# Altium schematic sheet CAN_HTTP_Enabled.SCHDOC: Weather Station with CAN interface
size C; Organization: Altium Limited; Address1: L3, 12a Rodborough Rd; Address2: Frenchs Forest; Address3: NSW; Address4: Australia 2086; DocumentNumber: 1; SheetNumber: 1; SheetTotal: 2
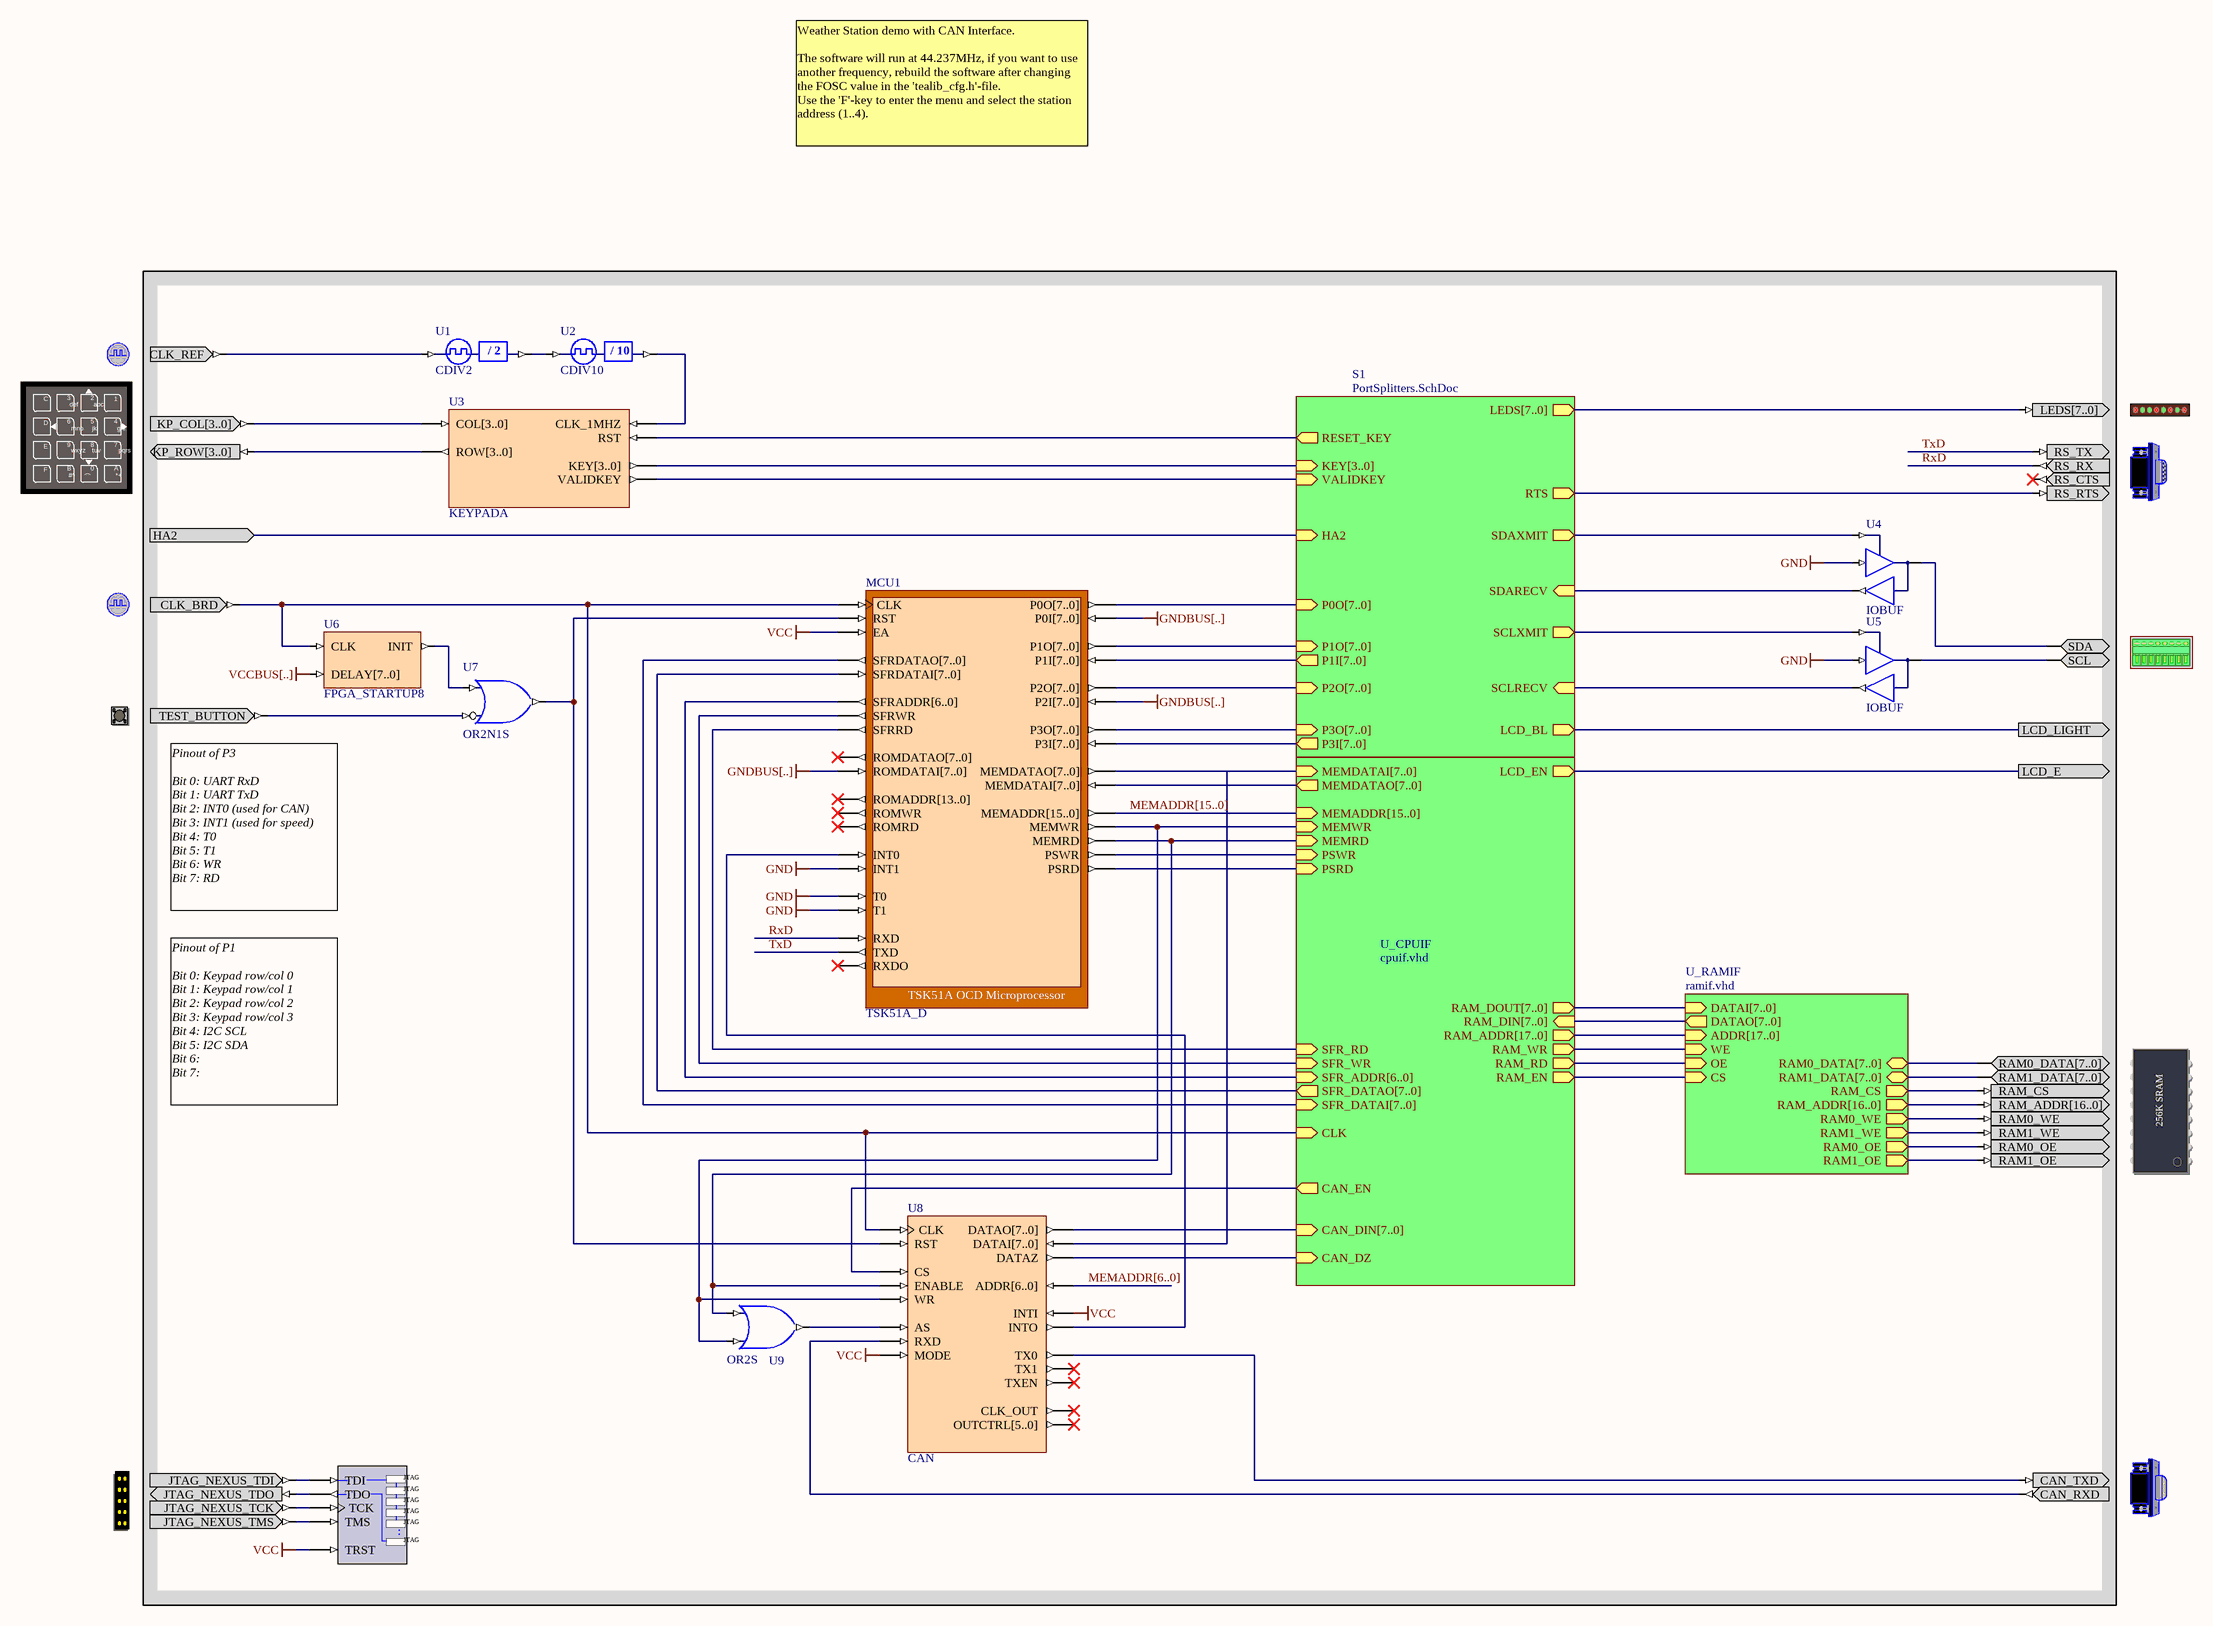
[diagram p0: CAN_HTTP_Enabled.SCHDOC]

## Parts
(Parts that share a designator on the sheet are numbered #1, #2 ... from top to bottom, then left to right.)
?#1  CLOCK_REFERENCE  (value not drawn)
?#2  KEYPAD  (value not drawn)
?#3  LED  (value not drawn)
?#4  RS232CNTR  (value not drawn)
?#5  CLOCK_BOARD  (value not drawn)
?#6  ADCDAC_I2C  (value not drawn)
?#7  TEST_BUTTON  (value not drawn)
?#8  MEMORY256KX8  (value not drawn)
?#9  CANCNTR  (value not drawn)
?#10  NEXUS_JTAG_CONNECTOR  (value not drawn)
MCU1  TSK51A_D
NEXUS_JTAG_PORT  NEXUS_JTAG_PORT  (value not drawn)
U1  CDIV2
U2  CDIV10
U3  KEYPADA
U4  IOBUF
U5  IOBUF
U6  FPGA_STARTUP8
U7  OR2N1S
U8  CAN
U9  OR2S

## Sub-sheets
S1 = PortSplitters.SchDoc: P0O[7..0] (in), P1O[7..0] (in), P1I[7..0] (out), P2O[7..0] (in), P3O[7..0] (in), P3I[7..0] (out), HA2 (in), SCLXMIT (out), LCD_BL (out), RTS (out), SDAXMIT (out), VALIDKEY (in), KEY[3..0] (in), SCLRECV (in), SDARECV (in), RESET_KEY (out), LEDS[7..0] (out)
U_CPUIF = cpuif.vhd: MEMWR (in), RAM_EN (out), RAM_WR (out), RAM_RD (out), RAM_DOUT[7..0] (out), MEMRD (in), LCD_EN (out), RAM_ADDR[17..0] (out), CLK (in), SFR_ADDR[6..0] (in), SFR_DATAI[7..0] (in), SFR_DATAO[7..0] (out), SFR_WR (in), SFR_RD (in), RAM_DIN[7..0] (in), PSWR (in), PSRD (in), MEMADDR[15..0] (in), MEMDATAI[7..0] (in), MEMDATAO[7..0] (out), CAN_EN (out), CAN_DIN[7..0] (in), CAN_DZ (in)
U_RAMIF = ramif.vhd: DATAI[7..0] (in), DATAO[7..0] (out), ADDR[17..0] (in), WE (in), OE (in), CS (in), RAM0_DATA[7..0] (bidir), RAM1_DATA[7..0] (bidir), RAM_ADDR[16..0] (out), RAM0_WE (out), RAM1_WE (out), RAM0_OE (out), RAM1_OE (out), RAM_CS (out)

## Ports
HA2 (in), LCD_E (out), LCD_LIGHT (out)

## Nets
GND: MCU1.INT1 MCU1.T0 MCU1.T1 U4.I U5.I
GNDBUS[..]: MCU1.P0I[7..0] MCU1.P2I[7..0] MCU1.ROMDATAI[7..0]
VCC: MCU1.EA NEXUS_JTAG_PORT.TRST U8.INTI U8.MODE
VCCBUS[..]: U6.DELAY[7..0]
HA2: port HA2, sheet S1/HA2
LCD_E: port LCD_E, sheet U_CPUIF/LCD_EN
LCD_LIGHT: port LCD_LIGHT, sheet S1/LCD_BL
MEMADDR[6..0]: U8.ADDR[6..0]
MEMADDR[15..0]: MCU1.MEMADDR[15..0] ; sheet U_CPUIF/MEMADDR[15..0]
RxD: ?#4.RS_RX MCU1.RXD
TxD: ?#4.RS_TX MCU1.TXD
Net?#1_CLK_REF: ?#1.CLK_REF U1.CLKIN
Net?#2_KP_COL[3..0]: ?#2.KP_COL[3..0] U3.COL[3..0]
Net?#2_KP_ROW[3..0]: ?#2.KP_ROW[3..0] U3.ROW[3..0]
Net?#3_LEDS[7..0]: ?#3.LEDS[7..0] ; sheet S1/LEDS[7..0]
Net?#4_RS_RTS: ?#4.RS_RTS ; sheet S1/RTS
Net?#5_CLK_BRD: ?#5.CLK_BRD MCU1.CLK U6.CLK U8.CLK ; sheet U_CPUIF/CLK
Net?#6_SCL: ?#6.SCL U5.IO
Net?#6_SDA: ?#6.SDA U4.IO
Net?#7_TEST_BUTTON: ?#7.TEST_BUTTON U7.I0
Net?#8_RAM0_DATA[7..0]: ?#8.RAM0_DATA[7..0] ; sheet U_RAMIF/RAM0_DATA[7..0]
Net?#8_RAM0_OE: ?#8.RAM0_OE ; sheet U_RAMIF/RAM0_OE
Net?#8_RAM0_WE: ?#8.RAM0_WE ; sheet U_RAMIF/RAM0_WE
Net?#8_RAM1_DATA[7..0]: ?#8.RAM1_DATA[7..0] ; sheet U_RAMIF/RAM1_DATA[7..0]
Net?#8_RAM1_OE: ?#8.RAM1_OE ; sheet U_RAMIF/RAM1_OE
Net?#8_RAM1_WE: ?#8.RAM1_WE ; sheet U_RAMIF/RAM1_WE
Net?#8_RAM_ADDR[16..0]: ?#8.RAM_ADDR[16..0] ; sheet U_RAMIF/RAM_ADDR[16..0]
Net?#8_RAM_CS: ?#8.RAM_CS ; sheet U_RAMIF/RAM_CS
Net?#9_CAN_RXD: ?#9.CAN_RXD U8.RXD
Net?#9_CAN_TXD: ?#9.CAN_TXD U8.TX0
Net?#10_JTAG_NEXUS_TCK: ?#10.JTAG_NEXUS_TCK NEXUS_JTAG_PORT.TCK
Net?#10_JTAG_NEXUS_TDI: ?#10.JTAG_NEXUS_TDI NEXUS_JTAG_PORT.TDI
Net?#10_JTAG_NEXUS_TDO: ?#10.JTAG_NEXUS_TDO NEXUS_JTAG_PORT.TDO
Net?#10_JTAG_NEXUS_TMS: ?#10.JTAG_NEXUS_TMS NEXUS_JTAG_PORT.TMS
NetMCU1_INT0: MCU1.INT0 U8.INTO
NetMCU1_MEMDATAI[7..0]: MCU1.MEMDATAI[7..0] ; sheet U_CPUIF/MEMDATAO[7..0]
NetMCU1_MEMDATAO[7..0]: MCU1.MEMDATAO[7..0] U8.DATAI[7..0] ; sheet U_CPUIF/MEMDATAI[7..0]
NetMCU1_MEMRD: MCU1.MEMRD U8.ENABLE U9.I0 ; sheet U_CPUIF/MEMRD
NetMCU1_MEMWR: MCU1.MEMWR U8.WR U9.I1 ; sheet U_CPUIF/MEMWR
NetMCU1_P0O[7..0]: MCU1.P0O[7..0] ; sheet S1/P0O[7..0]
NetMCU1_P1I[7..0]: MCU1.P1I[7..0] ; sheet S1/P1I[7..0]
NetMCU1_P1O[7..0]: MCU1.P1O[7..0] ; sheet S1/P1O[7..0]
NetMCU1_P2O[7..0]: MCU1.P2O[7..0] ; sheet S1/P2O[7..0]
NetMCU1_P3I[7..0]: MCU1.P3I[7..0] ; sheet S1/P3I[7..0]
NetMCU1_P3O[7..0]: MCU1.P3O[7..0] ; sheet S1/P3O[7..0]
NetMCU1_PSRD: MCU1.PSRD ; sheet U_CPUIF/PSRD
NetMCU1_PSWR: MCU1.PSWR ; sheet U_CPUIF/PSWR
NetMCU1_RST: MCU1.RST U7.O U8.RST
NetMCU1_SFRADDR[6..0]: MCU1.SFRADDR[6..0] ; sheet U_CPUIF/SFR_ADDR[6..0]
NetMCU1_SFRDATAI[7..0]: MCU1.SFRDATAI[7..0] ; sheet U_CPUIF/SFR_DATAO[7..0]
NetMCU1_SFRDATAO[7..0]: MCU1.SFRDATAO[7..0] ; sheet U_CPUIF/SFR_DATAI[7..0]
NetMCU1_SFRRD: MCU1.SFRRD ; sheet U_CPUIF/SFR_RD
NetMCU1_SFRWR: MCU1.SFRWR ; sheet U_CPUIF/SFR_WR
NetU1_CLKDV: U1.CLKDV U2.CLKIN
NetU2_CLKDV: U2.CLKDV U3.CLK_1MHZ
NetU3_KEY[3..0]: U3.KEY[3..0] ; sheet S1/KEY[3..0]
NetU3_RST: U3.RST ; sheet S1/RESET_KEY
NetU3_VALIDKEY: U3.VALIDKEY ; sheet S1/VALIDKEY
NetU4_O: U4.O ; sheet S1/SDARECV
NetU4_T: U4.T ; sheet S1/SDAXMIT
NetU5_O: U5.O ; sheet S1/SCLRECV
NetU5_T: U5.T ; sheet S1/SCLXMIT
NetU6_INIT: U6.INIT U7.I1
NetU8_AS: U8.AS U9.O
NetU8_CS: U8.CS ; sheet U_CPUIF/CAN_EN
NetU8_DATAO[7..0]: U8.DATAO[7..0] ; sheet U_CPUIF/CAN_DIN[7..0]
NetU8_DATAZ: U8.DATAZ ; sheet U_CPUIF/CAN_DZ
(unnamed): sheet U_CPUIF/RAM_EN, sheet U_RAMIF/CS
(unnamed): sheet U_CPUIF/RAM_WR, sheet U_RAMIF/WE
(unnamed): sheet U_CPUIF/RAM_RD, sheet U_RAMIF/OE

Not connected (* = marked no-connect by the designer): ?#4 RS_CTS*; MCU1 ROMADDR[13..0]* ROMDATAO[7..0]* ROMRD* ROMWR* RXDO*; U8 CLK_OUT* OUTCTRL[5..0]* TX1* TXEN*

## Buses and harness runs
bus MEMADDR[6..0]
bus MEMADDR[15..0] = sheet U_CPUIF/MEMADDR[15..0]
bus sheet U_CPUIF/RAM_ADDR[17..0] = sheet U_RAMIF/ADDR[17..0]
bus sheet U_CPUIF/RAM_DIN[7..0] = sheet U_RAMIF/DATAO[7..0]
bus sheet U_CPUIF/RAM_DOUT[7..0] = sheet U_RAMIF/DATAI[7..0]

## Notes on the sheet
- Weather Station demo with CAN Interface.
  The software will run at 44.237MHz, if you want to use another frequency, rebuild the software after changing the FOSC value in the 'tealib_cfg.h'-file.
  Use the 'F'-key to enter the menu and select the station address (1..4).
- Pinout of P3
  Bit 0: UART RxD
  Bit 1: UART TxD
  Bit 2: INT0 (used for CAN)
  Bit 3: INT1 (used for speed)
  Bit 4: T0
  Bit 5: T1
  Bit 6: WR
  Bit 7: RD
- Pinout of P1
  Bit 0: Keypad row/col 0
  Bit 1: Keypad row/col 1
  Bit 2: Keypad row/col 2
  Bit 3: Keypad row/col 3
  Bit 4: I2C SCL
  Bit 5: I2C SDA
  Bit 6:
  Bit 7:
- Title
- Size:
- Date:
- File:
- C
- Number:
- Time:
- Revision:
- Sheet
- of
- (in symbol CDIV2) / 2
- (in symbol CDIV10) / 10
- (in symbol KEYPAD) C; 3; 2; 1; def; abc; 6; 5; 4; D; mno; jkl; ghi; E; 9; 8; 7; wxyz; tuv; pqrs; F; B; 0; A; #^; (; *+
- (in symbol MEMORY256KX8) 256K SRAM
- (in symbol NEXUS_JTAG_PORT) JTAG; .

## Library data of the parts
?#1 = CLOCK_REFERENCE: Global System Clock Reference Supply; PortComponent: True; Published: 19-Nov-2003; Publisher: Altium Limited
?#2 = KEYPAD: Key Pad; PortComponent: True; Published: 19-Nov-2003; Publisher: Altium Limited
?#3 = LED: 8-Way LEDS; PortComponent: True; Published: 19-Nov-2003; Publisher: Altium Limited
?#4 = RS232CNTR: DCE Serial Port Connector; PortComponent: True; Published: 19-Nov-2003; Publisher: Altium Limited
?#5 = CLOCK_BOARD: Global System Clock Supply; PortComponent: True; Published: 19-Nov-2003; Publisher: Altium Limited
?#6 = ADCDAC_I2C: Analog Digital/ Digital Analog Converter, I2C Interface; PortComponent: True; Published: 19-Nov-2003; Publisher: Altium Limited
?#7 = TEST_BUTTON: Test Button; PortComponent: True; Published: 19-Nov-2003; Publisher: Altium Limited
?#8 = MEMORY256KX8: SRAM 256kx8; PortComponent: True; Published: 19-Nov-2003; Publisher: Altium Limited
?#9 = CANCNTR: CAN Bus Connector; PortComponent: True; Published: 19-Nov-2003; Publisher: Altium Limited
?#10 = NEXUS_JTAG_CONNECTOR: JTAG Port; PortComponent: True; Published: 19-Nov-2003; Publisher: Altium Limited
MCU1 = TSK51A_D: TSK51A OCD Microprocessor; NEXUS_CORE: Processor_OCDS; NEXUS_JTAG_DEVICE: True; NEXUS_JTAG_ORDER: 0; ChildModel1: RAM256x8_TSK51D; Published: 23/10/2003; Publisher: Altium Hobart Technology Centre; Core Revision: 1.00.00
NEXUS_JTAG_PORT = NEXUS_JTAG_PORT: Nexus Processor JTAG Chain Connector; NEXUS_JTAG_CONNECTOR: True; Published: 18-Nov-2003; Publisher: Altium Limited
U1 = CDIV2: Clock Divider by 2; ArchiveName: GENERIC; Published: 18-Nov-2003; Publisher: Altium Limited; Core Revision: 1.00.00
U2 = CDIV10: Clock Divider by 10; ArchiveName: GENERIC; Published: 18-Dec-2003; Publisher: Altium Limited; Core Revision: 1.00.00
U3 = KEYPADA: Keypad; Published: 2/01/2004; Publisher: Altium Hobart Technology Centre; Core Revision: 1.00.00
U4 U5 = IOBUF: Input/Output Buffer; ArchiveName: GENERIC; Published: 9-30-2003; Publisher: Altium Limited; Xilinx Equivalent: IOBUF; Core Revision: 1.00.00
U6 = FPGA_STARTUP8: FPGA Startup With 8 Bit Delay; Published: 21/01/2004; Publisher: Altium Hobart Technology Centre; Core Revision: 1.00.00
U7 = OR2N1S: 2-Input OR Gate with Active Low A Input, Single Pin Version; Xilinx Equivalent: OR2B1; ArchiveName: GENERIC; Published: 18-Dec-2003; Publisher: Altium Limited; Core Revision: 1.00.00
U8 = CAN: CAN Controller; ChildModel1: CAN10000_DRAM8X64; Published: 18/12/2003; Publisher: Altium Hobart Technology Centre; Core Revision: 1.00.00
U9 = OR2S: 2-Input OR Gate, Single Pin Version; Xilinx Equivalent: OR2; ArchiveName: GENERIC; VHDLIB_SIM: GENERIC_LIB; Published: 29-Jan-2004; Publisher: Altium Limited; Core Revision: 1.00.00